# EAGLE design piezo-layer_v0.95-R003 (EAGLE 6.5.0)
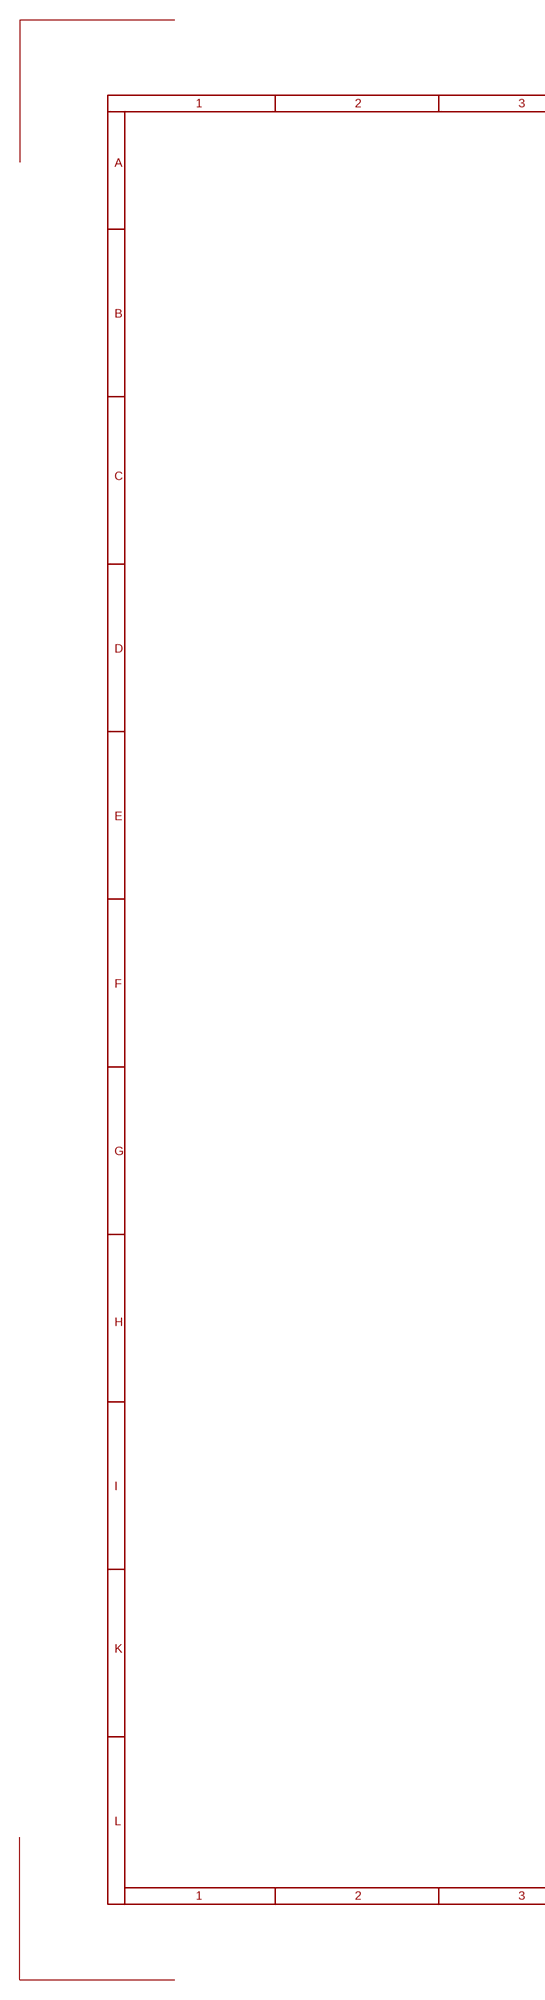
[diagram p0: schematic, sheet 1, part 1 of 2]
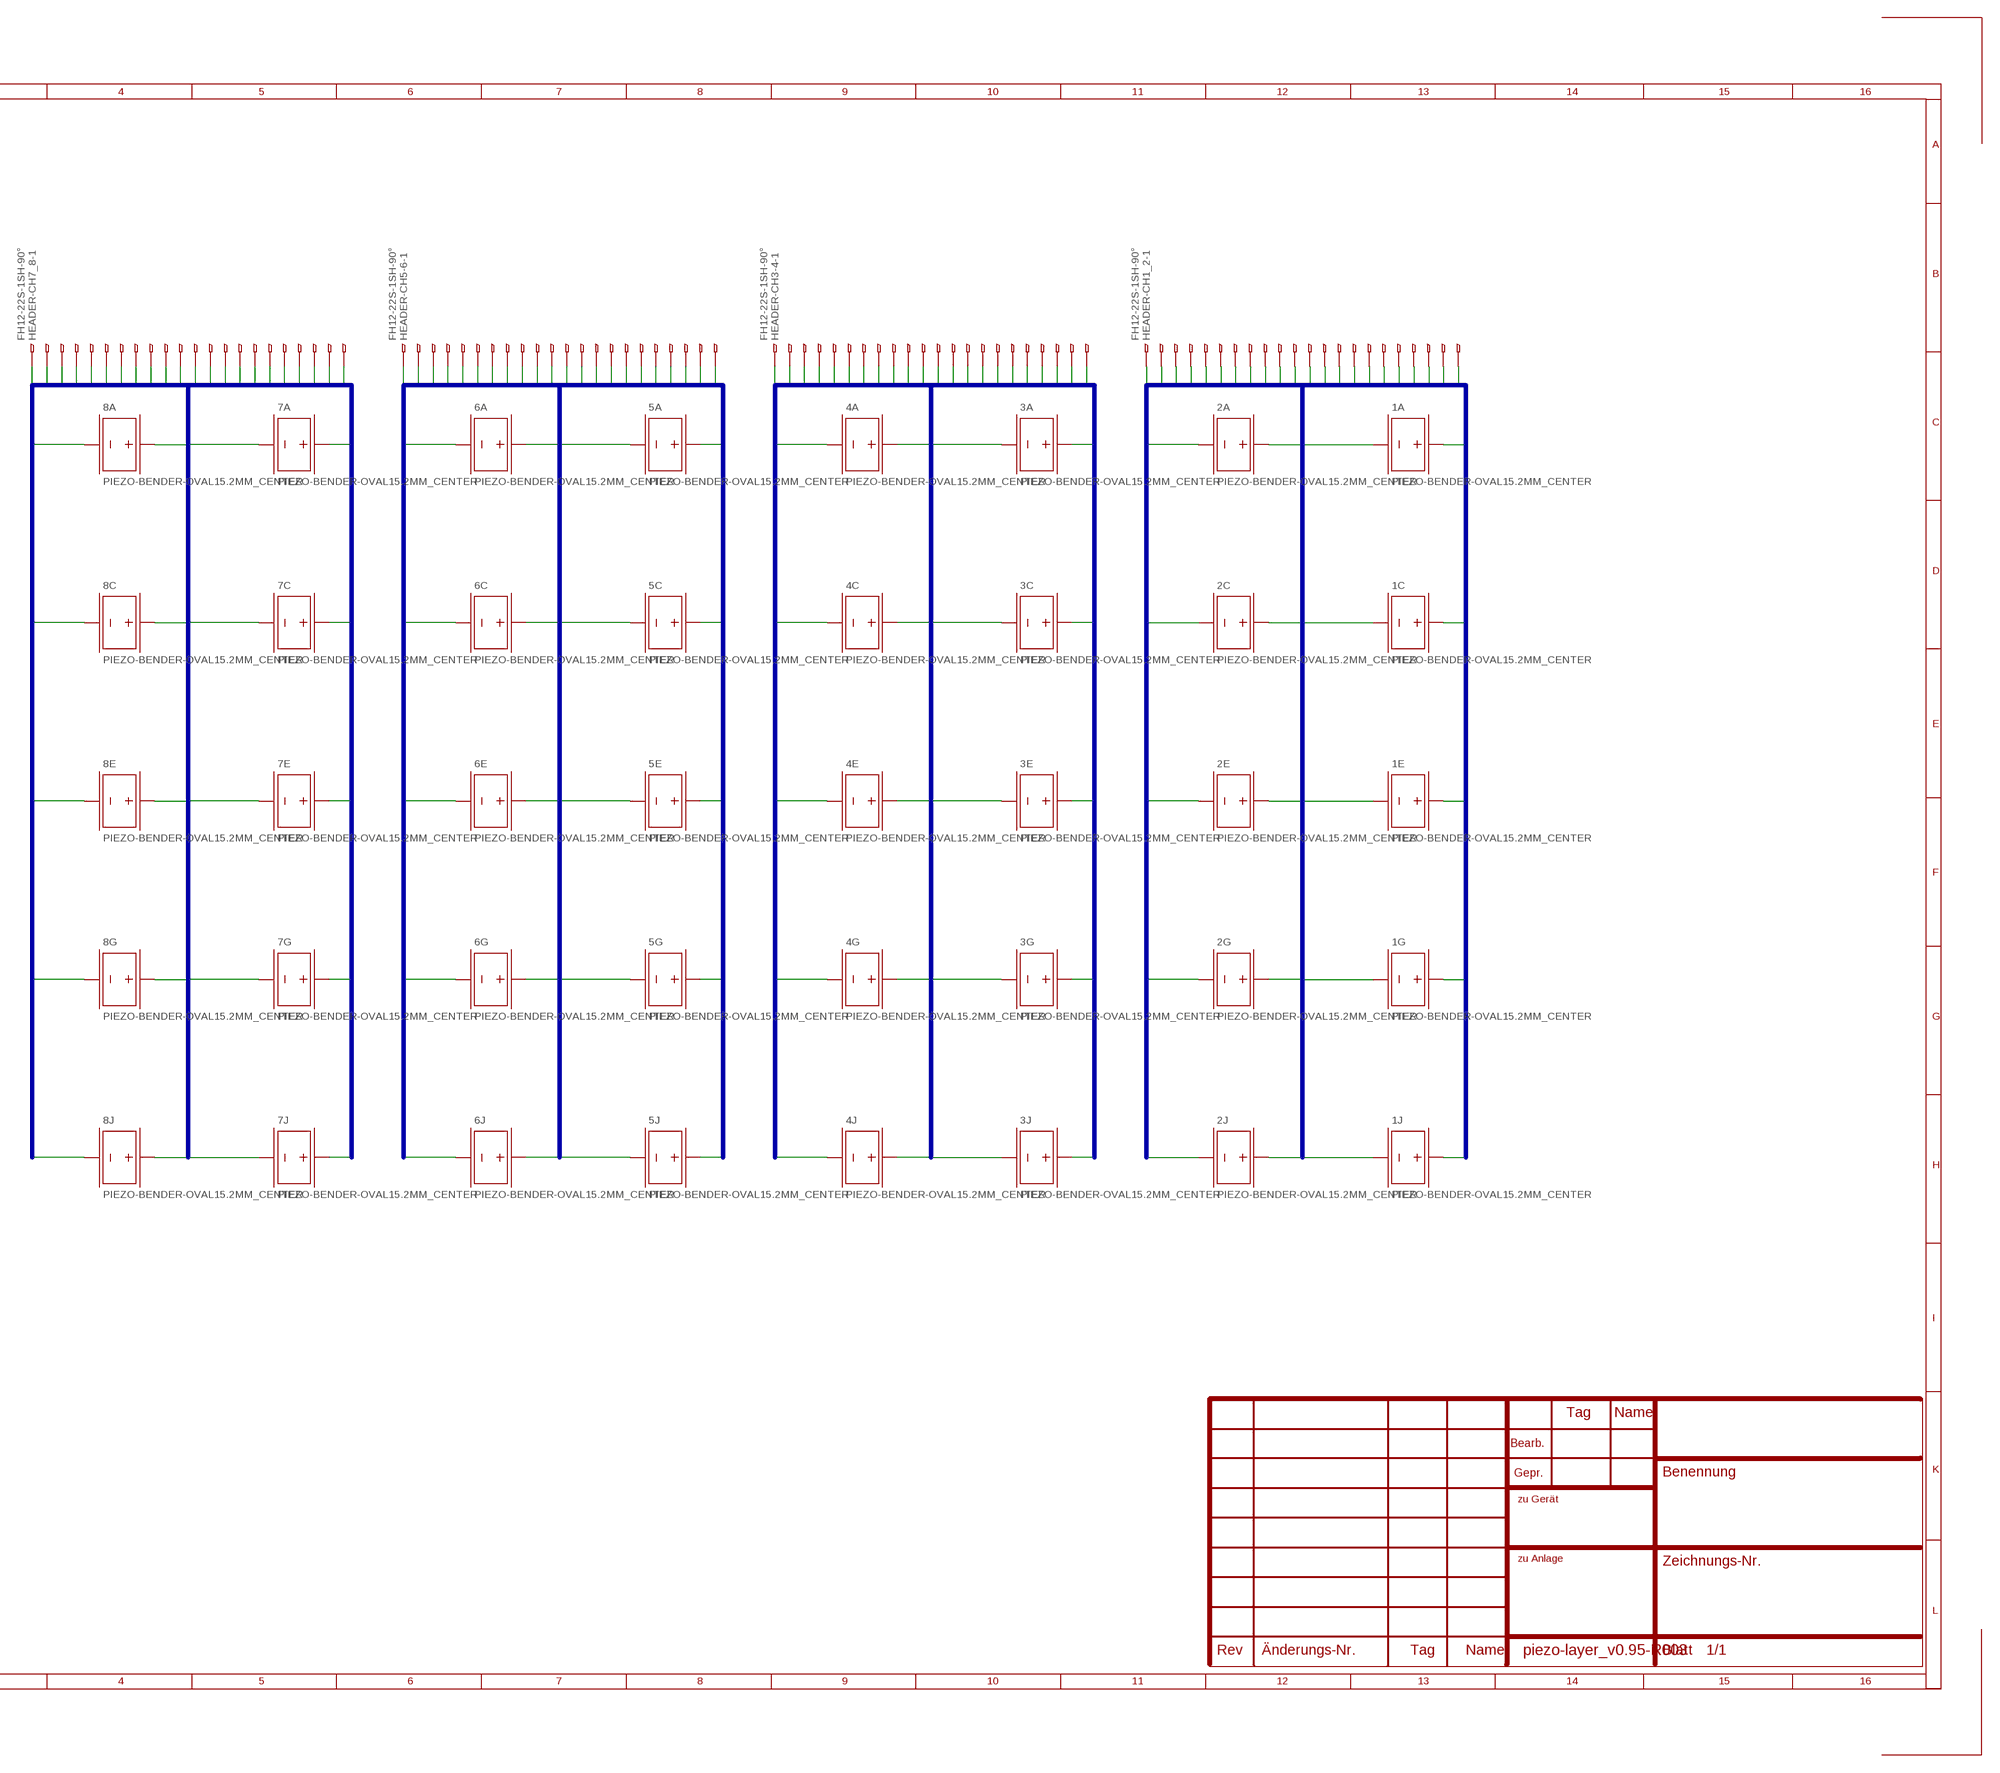
[diagram p1: schematic, sheet 1, part 2 of 2]

## Parts
1A  PIEZO-BENDER-OVAL15.2MM_CENTER  [PIEZO-BENDER-OVAL_15.2MM_BIGPADS_CENTER]
1C  PIEZO-BENDER-OVAL15.2MM_CENTER  [PIEZO-BENDER-OVAL_15.2MM_BIGPADS_CENTER]
1E  PIEZO-BENDER-OVAL15.2MM_CENTER  [PIEZO-BENDER-OVAL_15.2MM_BIGPADS_CENTER]
1G  PIEZO-BENDER-OVAL15.2MM_CENTER  [PIEZO-BENDER-OVAL_15.2MM_BIGPADS_CENTER]
1J  PIEZO-BENDER-OVAL15.2MM_CENTER  [PIEZO-BENDER-OVAL_15.2MM_BIGPADS_CENTER]
2A  PIEZO-BENDER-OVAL15.2MM_CENTER  [PIEZO-BENDER-OVAL_15.2MM_BIGPADS_CENTER]
2C  PIEZO-BENDER-OVAL15.2MM_CENTER  [PIEZO-BENDER-OVAL_15.2MM_BIGPADS_CENTER]
2E  PIEZO-BENDER-OVAL15.2MM_CENTER  [PIEZO-BENDER-OVAL_15.2MM_BIGPADS_CENTER]
2G  PIEZO-BENDER-OVAL15.2MM_CENTER  [PIEZO-BENDER-OVAL_15.2MM_BIGPADS_CENTER]
2J  PIEZO-BENDER-OVAL15.2MM_CENTER  [PIEZO-BENDER-OVAL_15.2MM_BIGPADS_CENTER]
3A  PIEZO-BENDER-OVAL15.2MM_CENTER  [PIEZO-BENDER-OVAL_15.2MM_BIGPADS_CENTER]
3C  PIEZO-BENDER-OVAL15.2MM_CENTER  [PIEZO-BENDER-OVAL_15.2MM_BIGPADS_CENTER]
3E  PIEZO-BENDER-OVAL15.2MM_CENTER  [PIEZO-BENDER-OVAL_15.2MM_BIGPADS_CENTER]
3G  PIEZO-BENDER-OVAL15.2MM_CENTER  [PIEZO-BENDER-OVAL_15.2MM_BIGPADS_CENTER]
3J  PIEZO-BENDER-OVAL15.2MM_CENTER  [PIEZO-BENDER-OVAL_15.2MM_BIGPADS_CENTER]
4A  PIEZO-BENDER-OVAL15.2MM_CENTER  [PIEZO-BENDER-OVAL_15.2MM_BIGPADS_CENTER]
4C  PIEZO-BENDER-OVAL15.2MM_CENTER  [PIEZO-BENDER-OVAL_15.2MM_BIGPADS_CENTER]
4E  PIEZO-BENDER-OVAL15.2MM_CENTER  [PIEZO-BENDER-OVAL_15.2MM_BIGPADS_CENTER]
4G  PIEZO-BENDER-OVAL15.2MM_CENTER  [PIEZO-BENDER-OVAL_15.2MM_BIGPADS_CENTER]
4J  PIEZO-BENDER-OVAL15.2MM_CENTER  [PIEZO-BENDER-OVAL_15.2MM_BIGPADS_CENTER]
5A  PIEZO-BENDER-OVAL15.2MM_CENTER  [PIEZO-BENDER-OVAL_15.2MM_BIGPADS_CENTER]
5C  PIEZO-BENDER-OVAL15.2MM_CENTER  [PIEZO-BENDER-OVAL_15.2MM_BIGPADS_CENTER]
5E  PIEZO-BENDER-OVAL15.2MM_CENTER  [PIEZO-BENDER-OVAL_15.2MM_BIGPADS_CENTER]
5G  PIEZO-BENDER-OVAL15.2MM_CENTER  [PIEZO-BENDER-OVAL_15.2MM_BIGPADS_CENTER]
5J  PIEZO-BENDER-OVAL15.2MM_CENTER  [PIEZO-BENDER-OVAL_15.2MM_BIGPADS_CENTER]
6A  PIEZO-BENDER-OVAL15.2MM_CENTER  [PIEZO-BENDER-OVAL_15.2MM_BIGPADS_CENTER]
6C  PIEZO-BENDER-OVAL15.2MM_CENTER  [PIEZO-BENDER-OVAL_15.2MM_BIGPADS_CENTER]
6E  PIEZO-BENDER-OVAL15.2MM_CENTER  [PIEZO-BENDER-OVAL_15.2MM_BIGPADS_CENTER]
6G  PIEZO-BENDER-OVAL15.2MM_CENTER  [PIEZO-BENDER-OVAL_15.2MM_BIGPADS_CENTER]
6J  PIEZO-BENDER-OVAL15.2MM_CENTER  [PIEZO-BENDER-OVAL_15.2MM_BIGPADS_CENTER]
7A  PIEZO-BENDER-OVAL15.2MM_CENTER  [PIEZO-BENDER-OVAL_15.2MM_BIGPADS_CENTER]
7C  PIEZO-BENDER-OVAL15.2MM_CENTER  [PIEZO-BENDER-OVAL_15.2MM_BIGPADS_CENTER]
7E  PIEZO-BENDER-OVAL15.2MM_CENTER  [PIEZO-BENDER-OVAL_15.2MM_BIGPADS_CENTER]
7G  PIEZO-BENDER-OVAL15.2MM_CENTER  [PIEZO-BENDER-OVAL_15.2MM_BIGPADS_CENTER]
7J  PIEZO-BENDER-OVAL15.2MM_CENTER  [PIEZO-BENDER-OVAL_15.2MM_BIGPADS_CENTER]
8A  PIEZO-BENDER-OVAL15.2MM_CENTER  [PIEZO-BENDER-OVAL_15.2MM_BIGPADS_CENTER]
8C  PIEZO-BENDER-OVAL15.2MM_CENTER  [PIEZO-BENDER-OVAL_15.2MM_BIGPADS_CENTER]
8E  PIEZO-BENDER-OVAL15.2MM_CENTER  [PIEZO-BENDER-OVAL_15.2MM_BIGPADS_CENTER]
8G  PIEZO-BENDER-OVAL15.2MM_CENTER  [PIEZO-BENDER-OVAL_15.2MM_BIGPADS_CENTER]
8J  PIEZO-BENDER-OVAL15.2MM_CENTER  [PIEZO-BENDER-OVAL_15.2MM_BIGPADS_CENTER]
HEADER-CH1_2  FH12-22S-1SH-90°  [FH12-22S-1SH]
HEADER-CH3-4  FH12-22S-1SH-90°  [FH12-22S-1SH]
HEADER-CH5-6  FH12-22S-1SH-90°  [FH12-22S-1SH]
HEADER-CH7_8  FH12-22S-1SH-90°  [FH12-22S-1SH]

## Nets
BUS1: 1J.TOP(+_1) HEADER-CH1_2.22
BUS2: HEADER-CH1_2.21
BUS3: 1E.TOP(+_1) HEADER-CH1_2.20
BUS4: HEADER-CH1_2.19
BUS5: 1A.BOTTOM(-_1) 1C.BOTTOM(-_1) 1E.BOTTOM(-_1) 1G.BOTTOM(-_1) 1J.BOTTOM(-_1) HEADER-CH1_2.12 HEADER-CH1_2.18
BUS6: 1A.TOP(+_1) HEADER-CH1_2.17
BUS7: HEADER-CH1_2.16
BUS8: 1C.TOP(+_1) HEADER-CH1_2.15
BUS9: HEADER-CH1_2.14
BUS10: 1G.TOP(+_1) HEADER-CH1_2.13
BUS11: 2J.TOP(+_1) HEADER-CH1_2.11
BUS12: HEADER-CH1_2.10
BUS13: 2E.TOP(+_1) HEADER-CH1_2.9
BUS14: HEADER-CH1_2.8
BUS15: 2A.BOTTOM(-_1) 2C.BOTTOM(-_1) 2E.BOTTOM(-_1) 2G.BOTTOM(-_1) 2J.BOTTOM(-_1) HEADER-CH1_2.1 HEADER-CH1_2.7
BUS16: 2A.TOP(+_1) HEADER-CH1_2.6
BUS17: HEADER-CH1_2.5
BUS18: 2C.TOP(+_1) HEADER-CH1_2.4
BUS19: HEADER-CH1_2.3
BUS20: 2G.TOP(+_1) HEADER-CH1_2.2
BUS21: 3J.TOP(+_1) HEADER-CH3-4.22
BUS22: HEADER-CH3-4.21
BUS23: 3E.TOP(+_1) HEADER-CH3-4.20
BUS24: HEADER-CH3-4.19
BUS25: 3A.BOTTOM(-_1) 3C.BOTTOM(-_1) 3E.BOTTOM(-_1) 3G.BOTTOM(-_1) 3J.BOTTOM(-_1) HEADER-CH3-4.12 HEADER-CH3-4.18
BUS26: 3A.TOP(+_1) HEADER-CH3-4.17
BUS27: HEADER-CH3-4.16
BUS28: 3C.TOP(+_1) HEADER-CH3-4.15
BUS29: HEADER-CH3-4.14
BUS30: 3G.TOP(+_1) HEADER-CH3-4.13
BUS31: 4J.TOP(+_1) HEADER-CH3-4.11
BUS32: HEADER-CH3-4.10
BUS33: 4E.TOP(+_1) HEADER-CH3-4.9
BUS34: HEADER-CH3-4.8
BUS35: 4A.BOTTOM(-_1) 4C.BOTTOM(-_1) 4E.BOTTOM(-_1) 4G.BOTTOM(-_1) 4J.BOTTOM(-_1) HEADER-CH3-4.1 HEADER-CH3-4.7
BUS36: 4A.TOP(+_1) HEADER-CH3-4.6
BUS37: HEADER-CH3-4.5
BUS38: 4C.TOP(+_1) HEADER-CH3-4.4
BUS39: HEADER-CH3-4.3
BUS40: 4G.TOP(+_1) HEADER-CH3-4.2
BUS41: 5J.TOP(+_1) HEADER-CH5-6.22
BUS42: HEADER-CH5-6.21
BUS43: 5E.TOP(+_1) HEADER-CH5-6.20
BUS44: HEADER-CH5-6.19
BUS45: 5A.BOTTOM(-_1) 5C.BOTTOM(-_1) 5E.BOTTOM(-_1) 5G.BOTTOM(-_1) 5J.BOTTOM(-_1) HEADER-CH5-6.12 HEADER-CH5-6.18
BUS46: 5A.TOP(+_1) HEADER-CH5-6.17
BUS47: HEADER-CH5-6.16
BUS48: 5C.TOP(+_1) HEADER-CH5-6.15
BUS49: HEADER-CH5-6.14
BUS50: 5G.TOP(+_1) HEADER-CH5-6.13
BUS51: 6J.TOP(+_1) HEADER-CH5-6.11
BUS52: HEADER-CH5-6.10
BUS53: 6E.TOP(+_1) HEADER-CH5-6.9
BUS54: HEADER-CH5-6.8
BUS55: 6A.BOTTOM(-_1) 6C.BOTTOM(-_1) 6E.BOTTOM(-_1) 6G.BOTTOM(-_1) 6J.BOTTOM(-_1) HEADER-CH5-6.1 HEADER-CH5-6.7
BUS56: 6A.TOP(+_1) HEADER-CH5-6.6
BUS57: HEADER-CH5-6.5
BUS58: 6C.TOP(+_1) HEADER-CH5-6.4
BUS59: HEADER-CH5-6.3
BUS60: 6G.TOP(+_1) HEADER-CH5-6.2
BUS61: 7J.TOP(+_1) HEADER-CH7_8.22
BUS62: HEADER-CH7_8.21
BUS63: 7E.TOP(+_1) HEADER-CH7_8.20
BUS64: HEADER-CH7_8.19
BUS65: 7A.BOTTOM(-_1) 7C.BOTTOM(-_1) 7E.BOTTOM(-_1) 7G.BOTTOM(-_1) 7J.BOTTOM(-_1) HEADER-CH7_8.12 HEADER-CH7_8.18
BUS66: 7A.TOP(+_1) HEADER-CH7_8.17
BUS67: HEADER-CH7_8.16
BUS68: 7C.TOP(+_1) HEADER-CH7_8.15
BUS69: HEADER-CH7_8.14
BUS70: 7G.TOP(+_1) HEADER-CH7_8.13
BUS71: 8J.TOP(+_1) HEADER-CH7_8.11
BUS72: HEADER-CH7_8.10
BUS73: 8E.TOP(+_1) HEADER-CH7_8.9
BUS74: HEADER-CH7_8.8
BUS75: 8A.BOTTOM(-_1) 8C.BOTTOM(-_1) 8E.BOTTOM(-_1) 8G.BOTTOM(-_1) 8J.BOTTOM(-_1) HEADER-CH7_8.1 HEADER-CH7_8.7
BUS76: 8A.TOP(+_1) HEADER-CH7_8.6
BUS77: HEADER-CH7_8.5
BUS78: 8C.TOP(+_1) HEADER-CH7_8.4
BUS79: HEADER-CH7_8.3
BUS80: 8G.TOP(+_1) HEADER-CH7_8.2

## Buses
BUS[1..20]
BUS[21..40]
BUS[41..60]
BUS[61..80]

## Library data of the parts
1A 1C 1E 1G 1J 2A 2C 2E 2G 2J 3A 3C 3E 3G 3J 4A 4C 4E 4G 4J 5A 5C 5E 5G 5J 6A 6C 6E 6G 6J 7A 7C 7E 7G 7J 8A 8C 8E 8G 8J = ICST:PIEZO-BENDER-OVAL
HEADER-CH1_2 HEADER-CH3-4 HEADER-CH5-6 HEADER-CH7_8 = ICST:FH12-22S-1SH

## Board
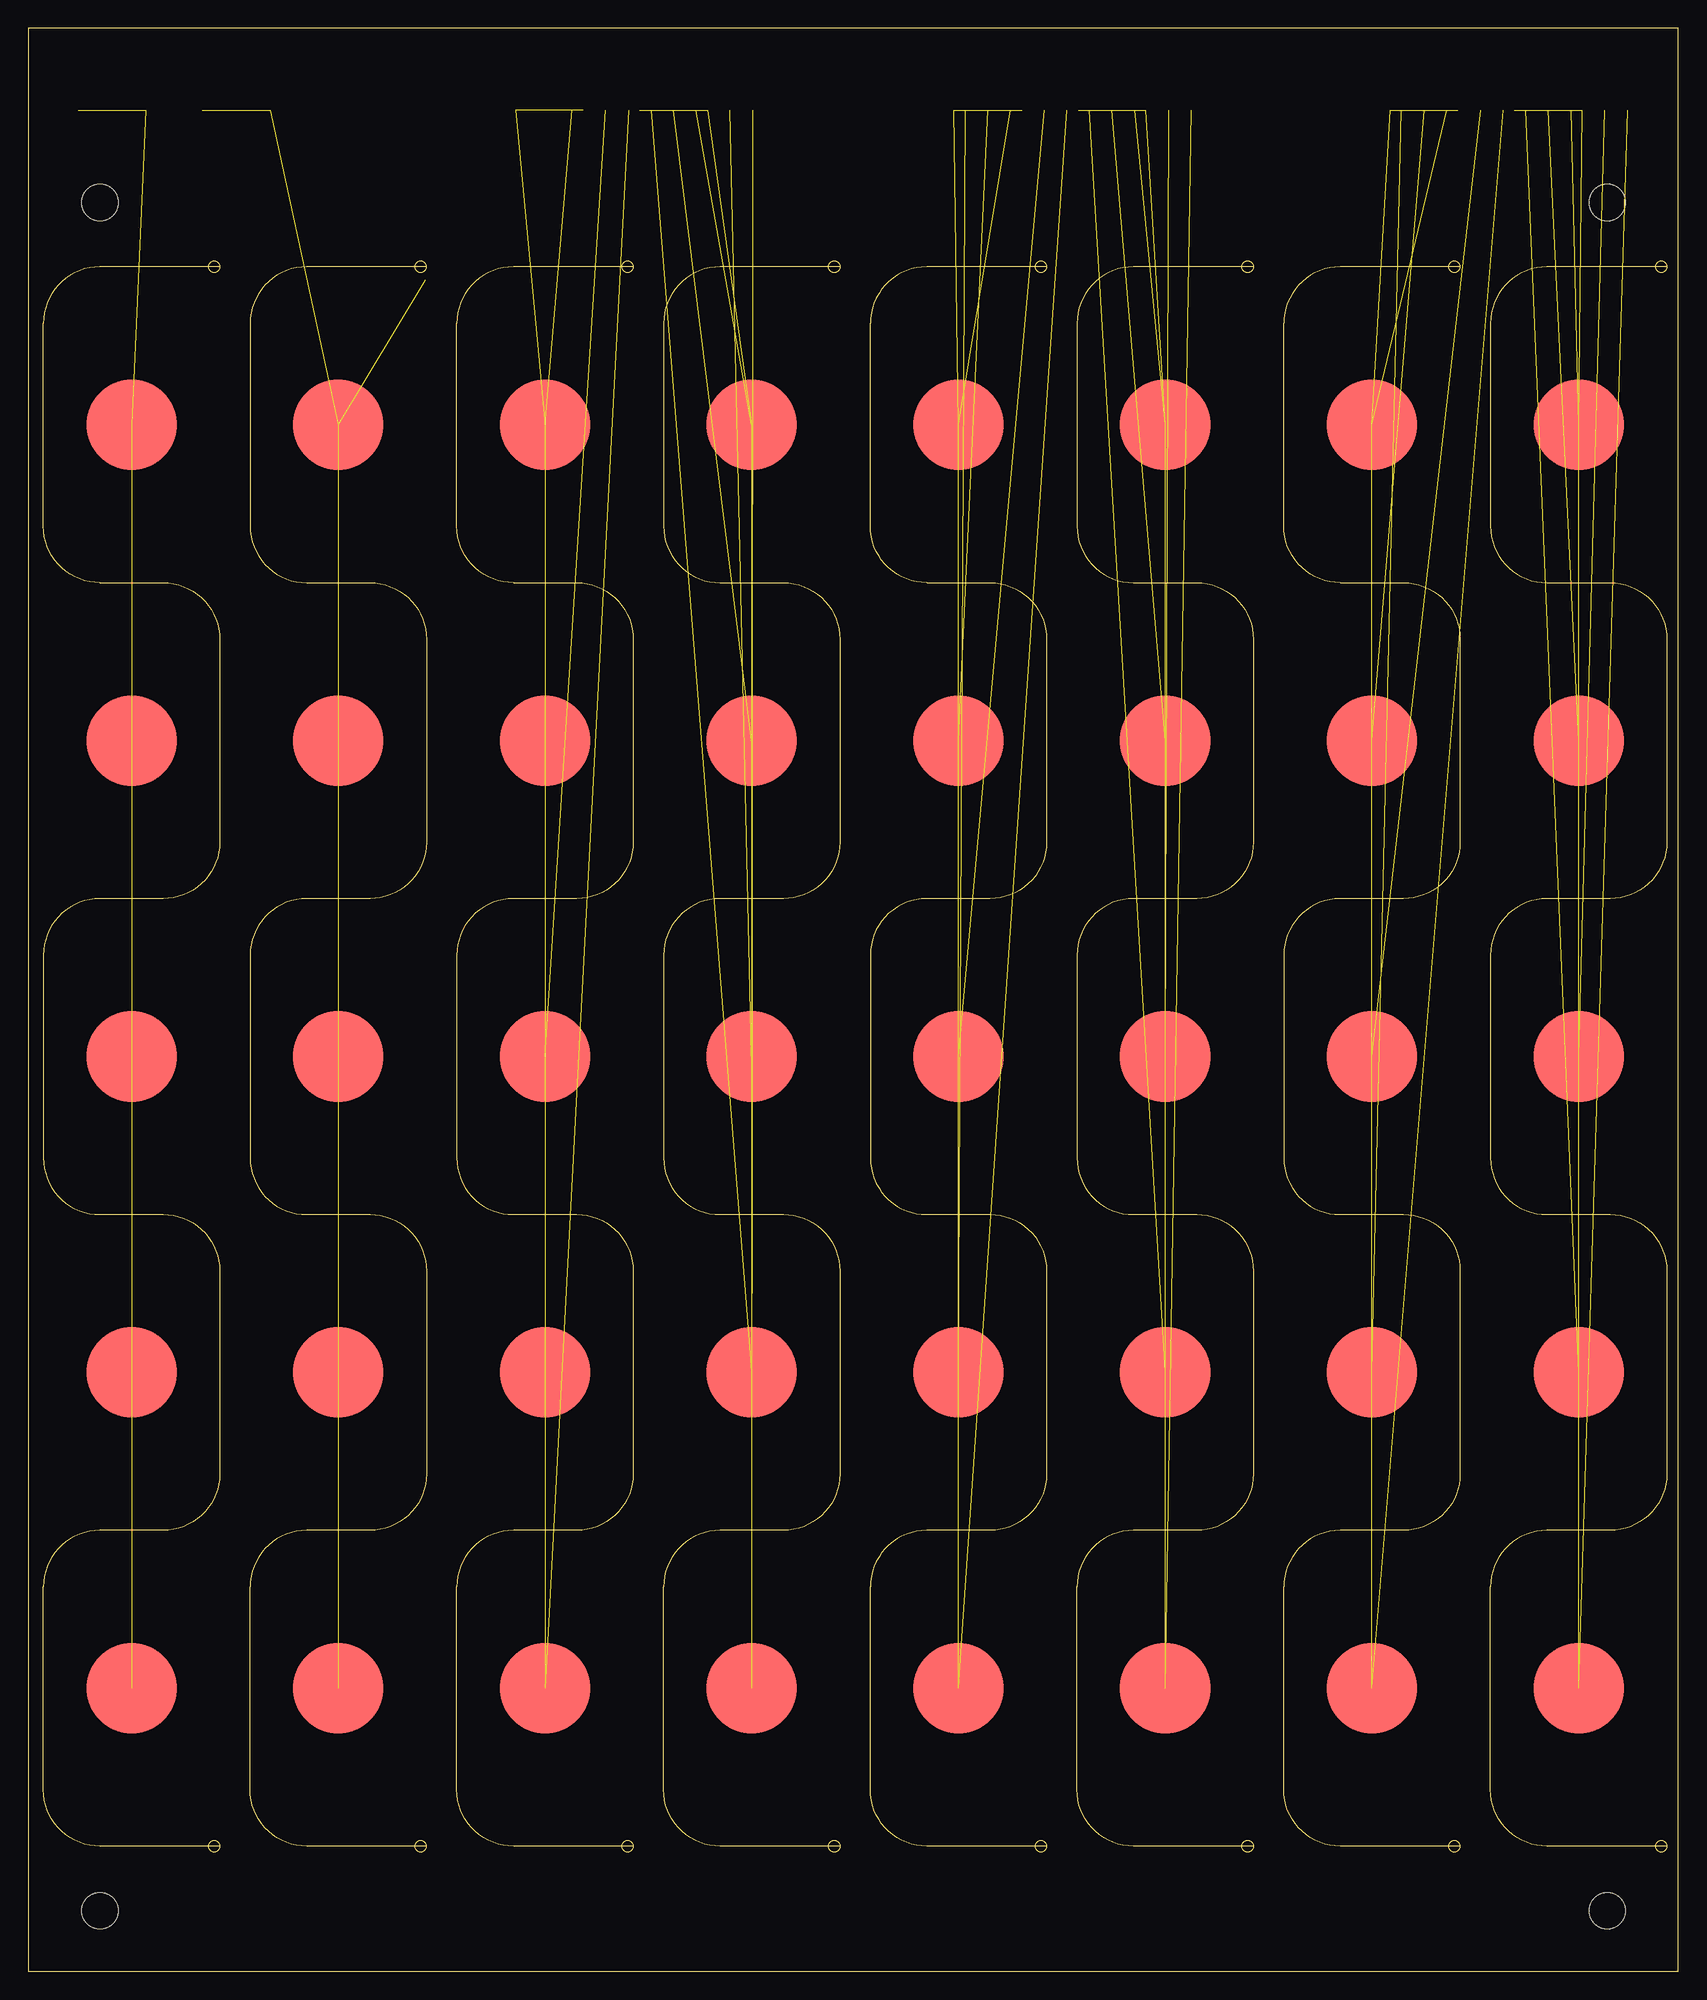
[diagram p2: board, top side]
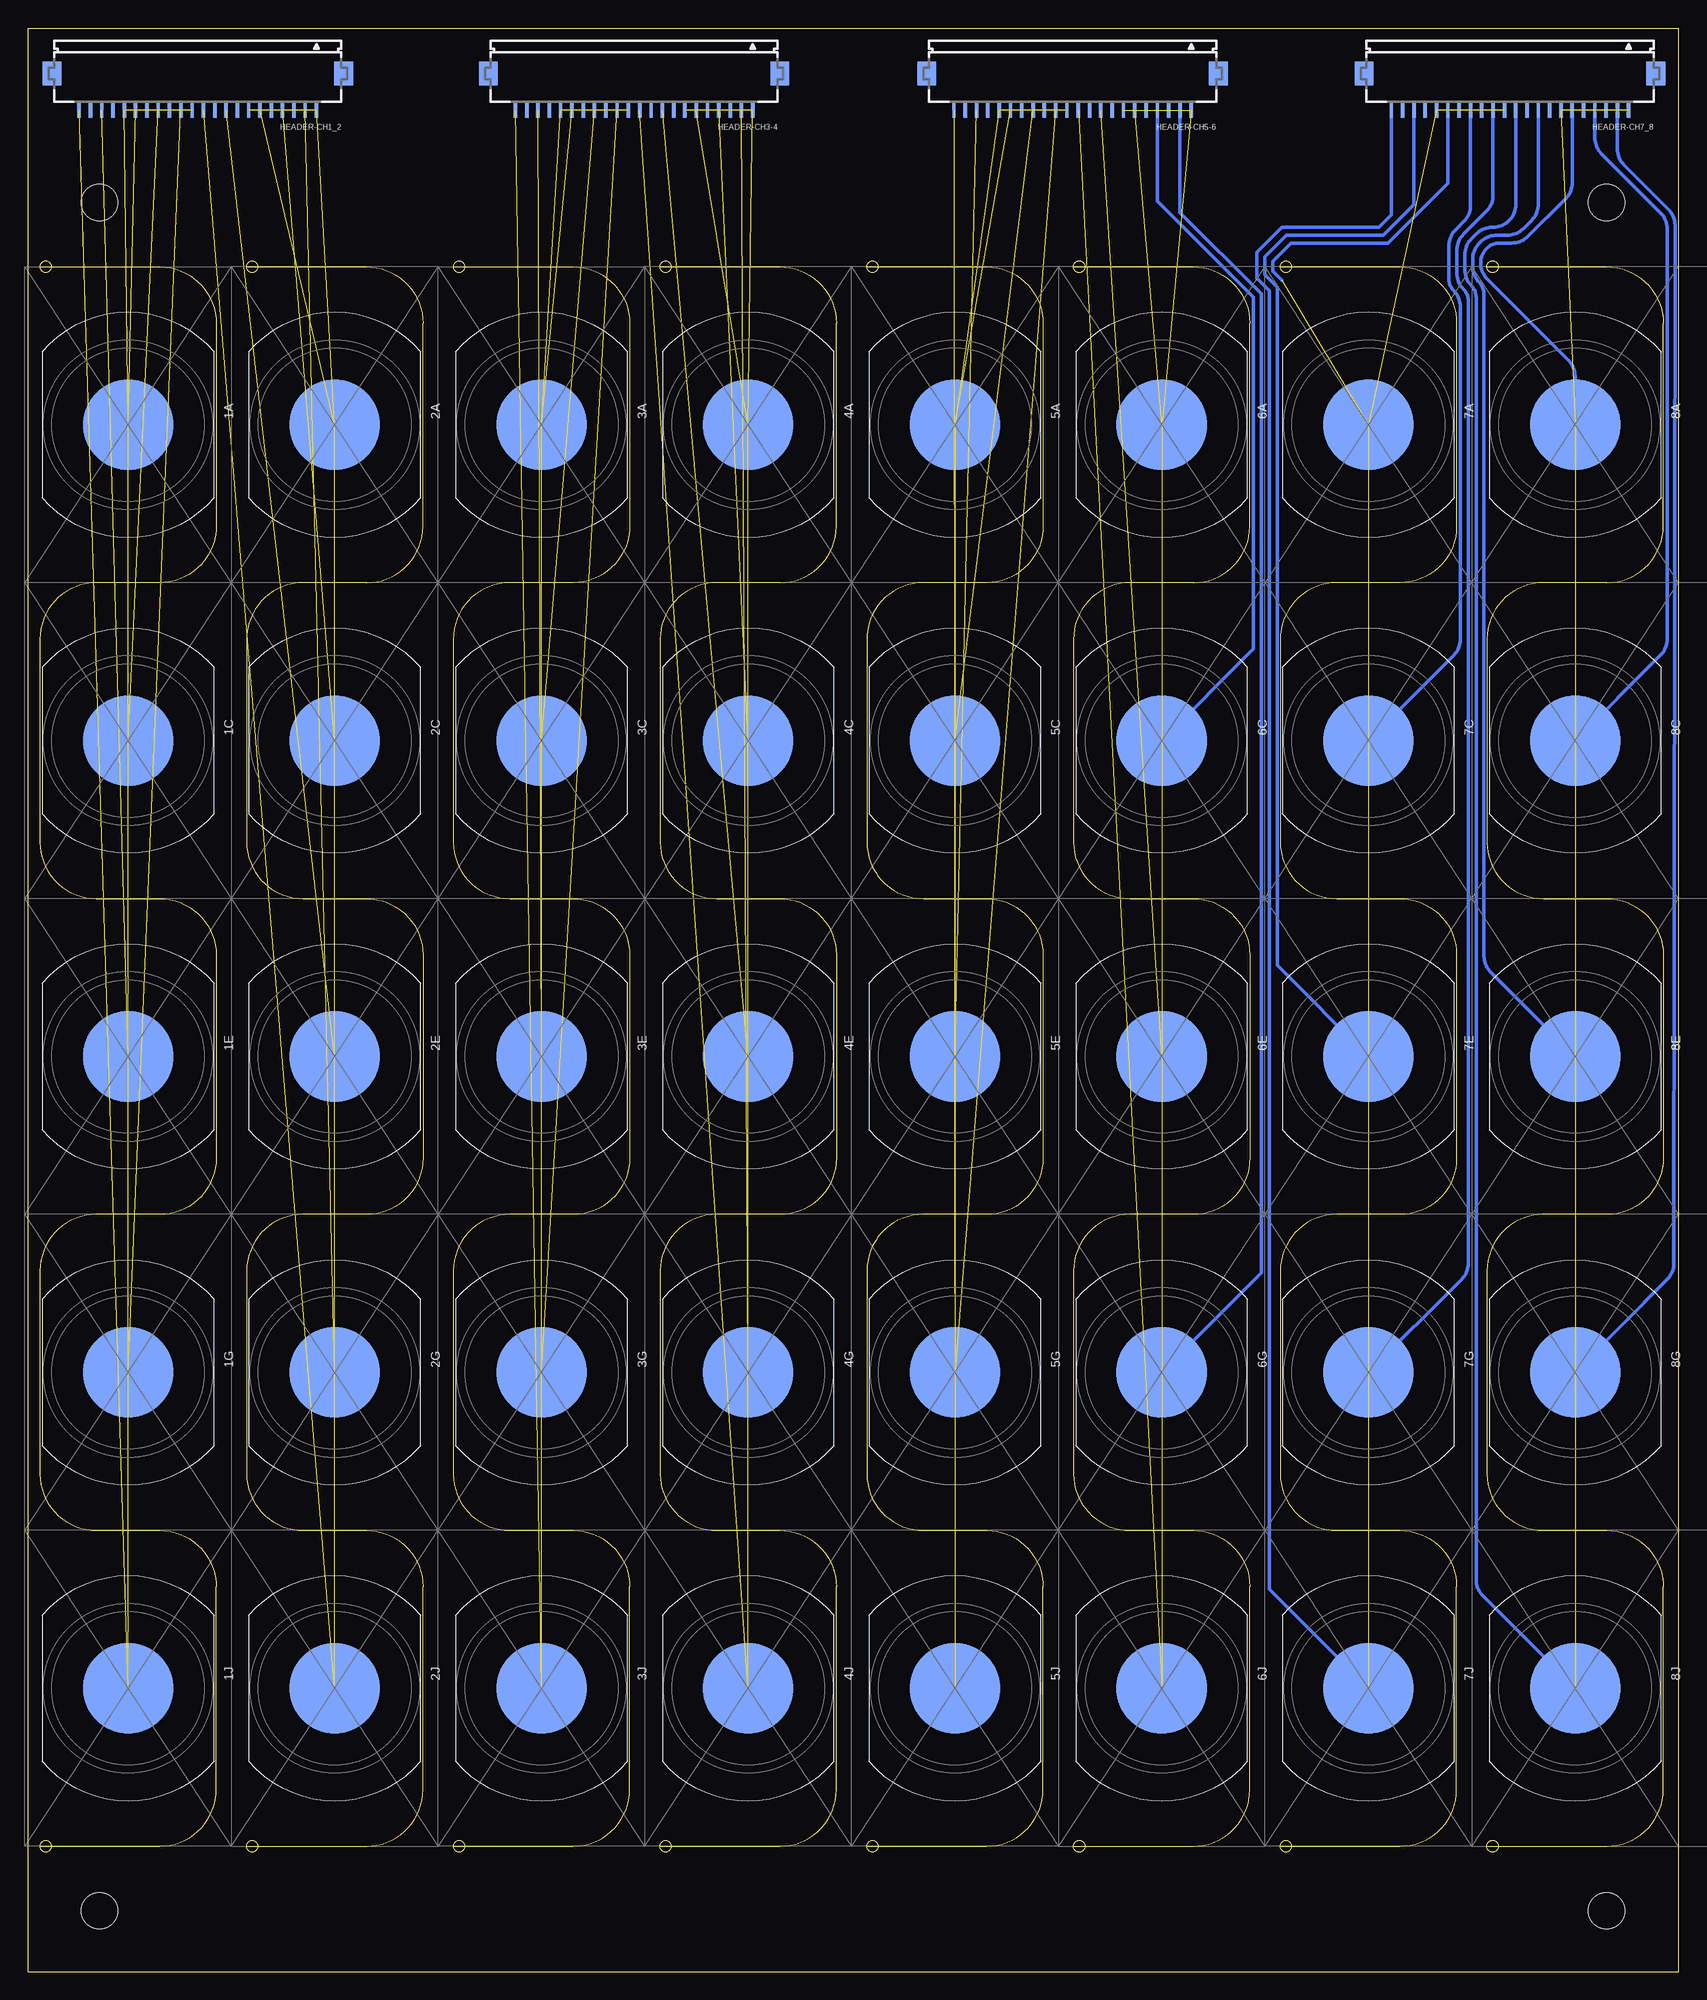
[diagram p3: board, bottom side, seen from below]

Size 146 x 171.9 mm. Coordinates in mm from the lower left corner, seen from the top.
Outline: 35.23,150.8 24.63,150.8 arc90 19.63,145.8 19.63,127.86 arc90 24.63,122.86 30.23,122.86 arc-90 35.23,117.86 35.23,99.92 arc-90 30.23,94.92 24.63,94.92 arc90 19.63,89.92 19.63,71.98 arc90 24.63,66.98 30.23,66.98 arc-90 35.23,61.98 35.23,44.04 arc-90 30.23,39.04 24.63,39.04 arc90 19.63,34.04 19.63,16.1 arc90 24.63,11.1 35.23,11.1
Outline: 16.94,150.8 6.34,150.8 arc90 1.34,145.8 1.34,127.86 arc90 6.34,122.86 11.94,122.86 arc-90 16.94,117.86 16.94,99.92 arc-90 11.94,94.92 6.34,94.92 arc90 1.34,89.92 1.34,71.98 arc90 6.34,66.98 11.94,66.98 arc-90 16.94,61.98 16.94,44.04 arc-90 11.94,39.04 6.34,39.04 arc90 1.34,34.04 1.34,16.1 arc90 6.34,11.1 16.94,11.1
Outline: 71.81,150.8 61.21,150.8 arc90 56.21,145.8 56.21,127.86 arc90 61.21,122.86 66.81,122.86 arc-90 71.81,117.86 71.81,99.92 arc-90 66.81,94.92 61.21,94.92 arc90 56.21,89.92 56.21,71.98 arc90 61.21,66.98 66.81,66.98 arc-90 71.81,61.98 71.81,44.04 arc-90 66.81,39.04 61.21,39.04 arc90 56.21,34.04 56.21,16.1 arc90 61.21,11.1 71.81,11.1
Outline: 53.52,150.8 42.92,150.8 arc90 37.92,145.8 37.92,127.86 arc90 42.92,122.86 48.52,122.86 arc-90 53.52,117.86 53.52,99.92 arc-90 48.52,94.92 42.92,94.92 arc90 37.92,89.92 37.92,71.98 arc90 42.92,66.98 48.52,66.98 arc-90 53.52,61.98 53.52,44.04 arc-90 48.52,39.04 42.92,39.04 arc90 37.92,34.04 37.92,16.1 arc90 42.92,11.1 53.52,11.1
Outline: 108.39,150.8 97.79,150.8 arc90 92.79,145.8 92.79,127.86 arc90 97.79,122.86 103.39,122.86 arc-90 108.39,117.86 108.39,99.92 arc-90 103.39,94.92 97.79,94.92 arc90 92.79,89.92 92.79,71.98 arc90 97.79,66.98 103.39,66.98 arc-90 108.39,61.98 108.39,44.04 arc-90 103.39,39.04 97.79,39.04 arc90 92.79,34.04 92.79,16.1 arc90 97.79,11.1 108.39,11.1
Outline: 90.1,150.8 79.5,150.8 arc90 74.5,145.8 74.5,127.86 arc90 79.5,122.86 85.1,122.86 arc-90 90.1,117.86 90.1,99.92 arc-90 85.1,94.92 79.5,94.92 arc90 74.5,89.92 74.5,71.98 arc90 79.5,66.98 85.1,66.98 arc-90 90.1,61.98 90.1,44.04 arc-90 85.1,39.04 79.5,39.04 arc90 74.5,34.04 74.5,16.1 arc90 79.5,11.1 90.1,11.1
Outline: 144.97,150.8 134.37,150.8 arc90 129.37,145.8 129.37,127.86 arc90 134.37,122.86 139.97,122.86 arc-90 144.97,117.86 144.97,99.92 arc-90 139.97,94.92 134.37,94.92 arc90 129.37,89.92 129.37,71.98 arc90 134.37,66.98 139.97,66.98 arc-90 144.97,61.98 144.97,44.04 arc-90 139.97,39.04 134.37,39.04 arc90 129.37,34.04 129.37,16.1 arc90 134.37,11.1 144.97,11.1
Outline: 126.68,150.8 116.08,150.8 arc90 111.08,145.8 111.08,127.86 arc90 116.08,122.86 121.68,122.86 arc-90 126.68,117.86 126.68,99.92 arc-90 121.68,94.92 116.08,94.92 arc90 111.08,89.92 111.08,71.98 arc90 116.08,66.98 121.68,66.98 arc-90 126.68,61.98 126.68,44.04 arc-90 121.68,39.04 116.08,39.04 arc90 111.08,34.04 111.08,16.1 arc90 116.08,11.1 126.68,11.1
Outline: 146,171.9 0,171.9 0,0 146,0 146,11.1 146,39.04 146,66.98 146,94.92 146,122.86 146,150.8 146,171.9
Outline: circle at 34.73,11.1 radius 0.5
Outline: circle at 16.44,11.1 radius 0.5
Outline: circle at 16.44,150.8 radius 0.5
Outline: circle at 34.73,150.8 radius 0.5
Outline: circle at 53.02,150.8 radius 0.5
Outline: circle at 53.02,11.1 radius 0.5
Outline: circle at 71.31,11.1 radius 0.5
Outline: circle at 89.6,11.1 radius 0.5
Outline: circle at 107.89,11.1 radius 0.5
Outline: circle at 126.18,11.1 radius 0.5
Outline: circle at 144.47,11.1 radius 0.5
Outline: circle at 71.31,150.8 radius 0.5
Outline: circle at 89.6,150.8 radius 0.5
Outline: circle at 107.89,150.8 radius 0.5
Outline: circle at 126.18,150.8 radius 0.5
Outline: circle at 144.47,150.8 radius 0.5
Copper layers 1*16: Top 0.012mm / dielectric 0.025mm / Bottom 0.012mm
Design rules "1L-0.025-0.15_0.3mm *": minimum track width 0.2mm, minimum drill 0.3mm, track to track 0.15mm, track to pad 0.15mm, pad to pad 0.15mm, via to via 0.15mm, smd to smd 0.15mm, copper to edge 0.5mm, drill to drill 1mm, minimum pad ring 10mil, minimum via ring 8mil, stop-mask expansion 4mil, vias tented up to drill 0mil, thermal gap 10mil
Holes 3.2 mm at 6.35,156.5 139.7,156.5 6.35,5.4 139.7,5.4

### Footprints (pad centres in the part's own frame; a part is rotated, then mirrored left to right if it is on the bottom)
PIEZO-BENDER-OVAL_15.2MM_BIGPADS_CENTER = smd 8 x 8 bottom: BOTTOM 0,0 | smd 8 x 8: TOP 0,0
FH12-22S-1SH = smd 0.3 x 1.3: 1 -10.5,3.25; 2 -9.5,3.25; 3 -8.5,3.25; 4 -7.5,3.25; 5 -6.5,3.25; 6 -5.5,3.25; 7 -4.5,3.25; 8 -3.5,3.25; 9 -2.5,3.25; 10 -1.5,3.25; 11 -0.5,3.25; 12 0.5,3.25; 13 1.5,3.25; 14 2.5,3.25; 15 3.5,3.25; 16 4.5,3.25; 17 5.5,3.25; 18 6.5,3.25; 19 7.5,3.25; 20 8.5,3.25; 21 9.5,3.25; 22 10.5,3.25 | smd 1.65 x 2.05: PAD1 -12.9,0; PAD2 12.9,0

### Placement (x,y rotation side)
1A  137.17,136.83 270 bottom
1C  137.17,108.89 270 bottom
1E  137.17,80.95 270 bottom
1G  137.17,53.01 270 bottom
1J  137.17,25.07 270 bottom
2A  118.88,136.83 270 bottom
2C  118.88,108.89 270 bottom
2E  118.88,80.95 270 bottom
2G  118.88,53.01 270 bottom
2J  118.88,25.07 270 bottom
3A  100.59,136.83 270 bottom
3C  100.59,108.89 270 bottom
3E  100.59,80.95 270 bottom
3G  100.59,53.01 270 bottom
3J  100.59,25.07 270 bottom
4A  82.3,136.83 270 bottom
4C  82.3,108.89 270 bottom
4E  82.3,80.95 270 bottom
4G  82.3,53.01 270 bottom
4J  82.3,25.07 270 bottom
5A  64.01,136.83 270 bottom
5C  64.01,108.89 270 bottom
5E  64.01,80.95 270 bottom
5G  64.01,53.01 270 bottom
5J  64.01,25.07 270 bottom
6A  45.72,136.83 270 bottom
6C  45.72,108.89 270 bottom
6E  45.72,80.95 270 bottom
6G  45.72,53.01 270 bottom
6J  45.72,25.07 270 bottom
7A  27.43,136.83 270 bottom
7C  27.43,108.89 270 bottom
7E  27.43,80.95 270 bottom
7G  27.43,53.01 270 bottom
7J  27.43,25.07 270 bottom
8A  9.14,136.83 270 bottom
8C  9.14,108.89 270 bottom
8E  9.14,80.95 270 bottom
8G  9.14,53.01 270 bottom
8J  9.14,25.07 270 bottom
HEADER-CH1_2  131,167.9 180 bottom
HEADER-CH3-4  92.4,167.9 180 bottom
HEADER-CH5-6  53.6,167.9 180 bottom
HEADER-CH7_8  14.9,167.9 180 bottom

### Tracks (layer width: path | path; a pad name or v marks a point on that pad's centre or on a via)
BUS1  (1 unrouted)
BUS3  (1 unrouted)
BUS5  (6 unrouted)
BUS6  (1 unrouted)
BUS8  (1 unrouted)
BUS10  (1 unrouted)
BUS11  (1 unrouted)
BUS13  (1 unrouted)
BUS15  (6 unrouted)
BUS16  (1 unrouted)
BUS18  (1 unrouted)
BUS20  (1 unrouted)
BUS21  (1 unrouted)
BUS23  (1 unrouted)
BUS25  (6 unrouted)
BUS26  (1 unrouted)
BUS28  (1 unrouted)
BUS30  (1 unrouted)
BUS31  (1 unrouted)
BUS33  (1 unrouted)
BUS35  (6 unrouted)
BUS36  (1 unrouted)
BUS38  (1 unrouted)
BUS40  (1 unrouted)
BUS41  (1 unrouted)
BUS43  (1 unrouted)
BUS45  (6 unrouted)
BUS46  (1 unrouted)
BUS48  (1 unrouted)
BUS50  (1 unrouted)
BUS51  (1 unrouted)
BUS53  (1 unrouted)
BUS55  (6 unrouted)
BUS56  (1 unrouted)
BUS58
  Bottom 0.3: HEADER-CH5-6.4 46.1,156.6 37.6,148.1 37.6,117.01 6C.TOP
BUS60
  Bottom 0.3: HEADER-CH5-6.2 44.1,155.6 36.9,148.4 36.9,61.83 6G.TOP
BUS61
  Bottom 0.3: HEADER-CH7_8.22 25.4,155.4 26.5,154.3 35.1,154.3 37.3,152.1 37.3,149.8 36.2,148.7 36.2,33.84 7J.TOP
BUS63
  Bottom 0.3: HEADER-CH7_8.20 23.4,156.3 26.1,153.6 34.7,153.6 36.6,151.7 36.6,150.1 35.5,149 35.5,89.02 7E.TOP
BUS65  (6 unrouted)
BUS66  (1 unrouted)
  Bottom 0.3: HEADER-CH7_8.17 20.4,158.2 25.7,152.9 34.3,152.9 35.9,151.3 35.9,150.4 35.1,149.6
BUS68
  Bottom 0.3: HEADER-CH7_8.15 18.4,156.23 arc45 18.99,154.81 19.71,154.09 arc-45 20.3,152.67 20.3,149.69 arc-45 19.89,148.69 arc45 19.3,147.27 19.3,117.85 arc45 19.89,116.43 7C.TOP
BUS70
  Bottom 0.3: HEADER-CH7_8.13 16.4,157.13 arc45 16.99,155.71 19.01,153.69 arc-45 19.6,152.27 19.6,150.23 arc-45 19.01,148.81 arc45 18.6,147.81 18.6,62.67 arc45 19.19,61.25 7G.TOP
BUS71
  Bottom 0.3: HEADER-CH7_8.11 14.4,156.3 arc90 16.4,154.3 16.47,154.3 arc-45 17.89,153.71 18.31,153.29 arc-45 18.9,151.87 18.9,150.53 arc-45 18.31,149.11 arc45 17.9,148.11 17.9,34.66 arc-45 17.31,33.24 8J.TOP
BUS73
  Bottom 0.3: HEADER-CH7_8.9 12.4,156.33 arc45 12.99,154.91 13.71,154.19 arc45 15.13,153.6 16.07,153.6 arc-45 17.49,153.01 17.61,152.89 arc-45 18.2,151.47 18.2,150.83 arc-45 17.61,149.41 arc45 17.2,148.41 17.2,89.84 arc-45 16.61,88.42 8E.TOP
BUS75  (6 unrouted)
BUS76
  Bottom 0.3: HEADER-CH7_8.6 9.4,158.23 arc45 9.99,156.81 13.31,153.49 arc45 14.73,152.9 15.86,152.9 arc-45 16.95,152.45 arc-45 17.5,151.13 arc-45 16.91,149.71 9.73,142.53 arc45 9.14,141.11 8A.TOP
BUS78
  Bottom 0.3: HEADER-CH7_8.4 7.4,162.23 arc-45 6.81,160.81 1.59,155.59 arc45 1,154.17 1,117.86 arc45 1.59,116.44 8C.TOP
BUS80
  Bottom 0.3: HEADER-CH7_8.2 5.4,161.23 arc-45 4.81,159.81 0.89,155.89 arc45 0.3,154.47 0.4,62.67 arc45 0.98,61.27 8G.TOP